# EAGLE design eCog002_Proto_SMD (EAGLE 6.6.0)
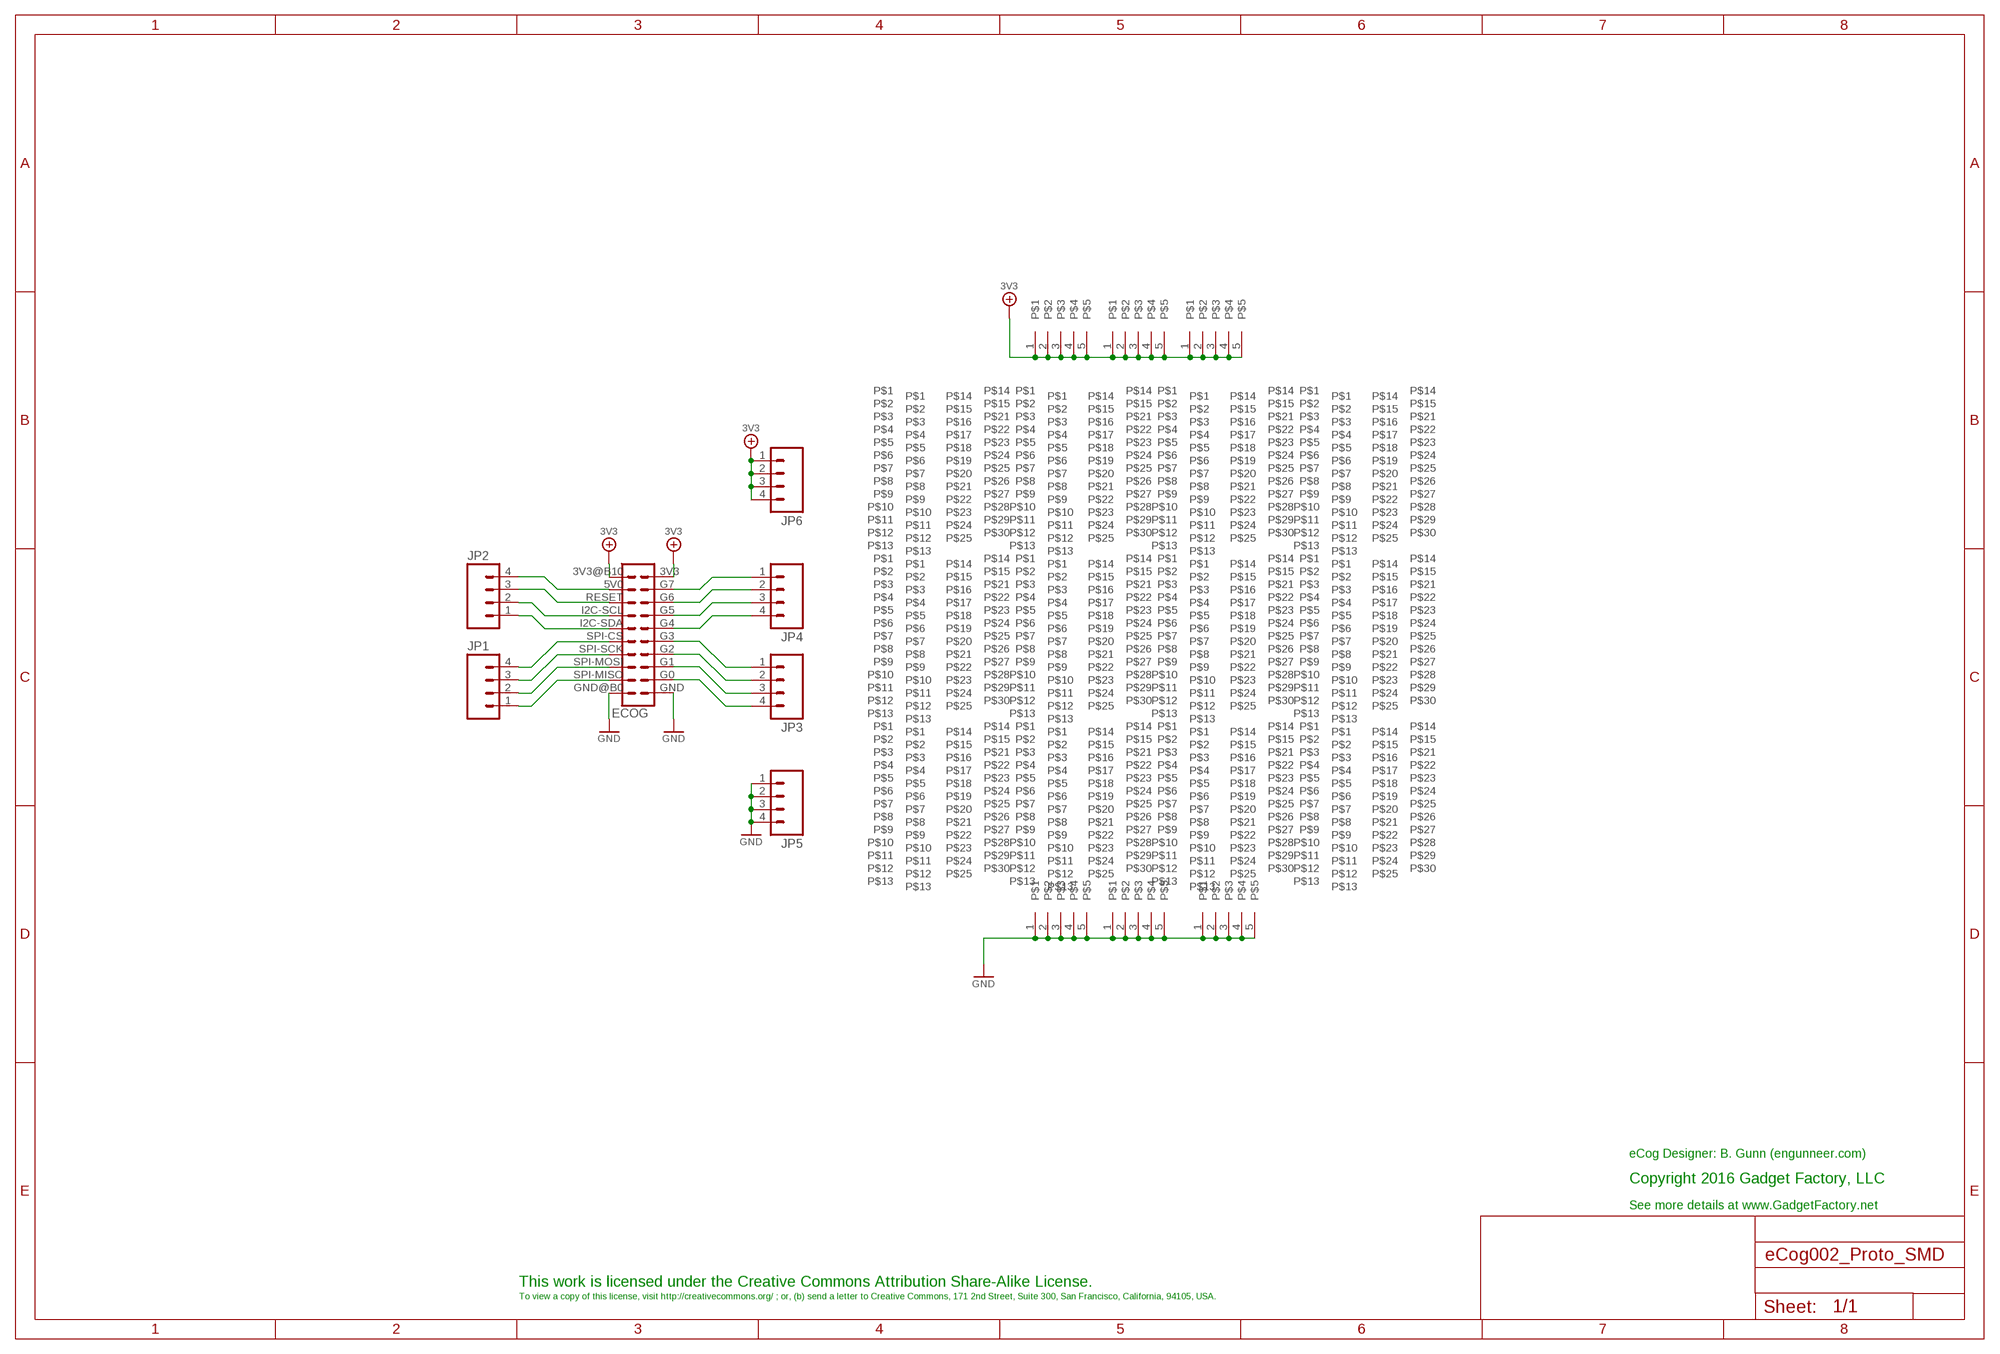
[diagram p0: schematic, sheet 1]

## Parts
ECOG  ECOG_DUALTHROUGHHOLE  [ECOG_DUAL_TH]
JP1  M041.27MM  [1X04-1.27MM]
JP2  M041.27MM  [1X04-1.27MM]
JP3  M041.27MM  [1X04-1.27MM]
JP4  M041.27MM  [1X04-1.27MM]
JP5  M041.27MM  [1X04-1.27MM]
JP6  M041.27MM  [1X04-1.27MM]
U$2  SMD_PROTO_2550X65  [SMD-5065]
U$3  SMD_PROTO_2550X65  [SMD-5065]
U$4  SMD_PROTO_2550X65  [SMD-5065]
U$5  SMD_PROTO_2550X65  [SMD-5065]
U$6  SMD_PROTO_2550X65  [SMD-5065]
U$7  SMD_PROTO_2550X65  [SMD-5065]
U$8  SMD_PROTO_2550X65  [SMD-5065]
U$9  SMD_PROTO_2550X65  [SMD-5065]
U$11  SMD_PROTO_2550X65  [SMD-5065]
U$12  SMD_PROTO_2550X65  [SMD-5065]
U$13  SMD_PROTO_2550X65  [SMD-5065]
U$14  SMD_PROTO_2550X65  [SMD-5065]
U$15  SMD_PROTO_55  [SMD-5065-5]
U$16  SMD_PROTO_55  [SMD-5065-5]
U$17  SMD_PROTO_55  [SMD-5065-5]
U$18  SMD_PROTO_55  [SMD-5065-5]
U$19  SMD_PROTO_55  [SMD-5065-5]
U$20  SMD_PROTO_55  [SMD-5065-5]

## Nets
3V3: ECOG.3V3 ECOG.3V3@B10(3V3) JP6.1 JP6.2 JP6.3 JP6.4 U$15.1 U$15.2 U$15.3 U$15.4 U$15.5 U$16.1 U$16.2 U$16.3 U$16.4 U$16.5 U$17.1 U$17.2 U$17.3 U$17.4 U$17.5
GND: ECOG.GND ECOG.GND@B0(GND) JP5.1 JP5.2 JP5.3 JP5.4 U$18.1 U$18.2 U$18.3 U$18.4 U$18.5 U$19.1 U$19.2 U$19.3 U$19.4 U$19.5 U$20.1 U$20.2 U$20.3 U$20.4 U$20.5
N$1: ECOG.G7 JP4.1
N$2: ECOG.G6 JP4.2
N$3: ECOG.G5 JP4.3
N$4: ECOG.G4 JP4.4
N$5: ECOG.G3 JP3.1
N$6: ECOG.G2 JP3.2
N$7: ECOG.G1 JP3.3
N$8: ECOG.G0 JP3.4
N$9: ECOG.SPI-MISO JP1.1
N$10: ECOG.SPI-MOSI JP1.2
N$11: ECOG.SPI-SCK JP1.3
N$12: ECOG.SPI-CS JP1.4
N$13: ECOG.I2C-SDA JP2.1
N$14: ECOG.I2C-SCL JP2.2
N$15: ECOG.RESET JP2.3
N$16: ECOG.5V0(5V) JP2.4
Unconnected: U$2.P$1 U$2.P$2 U$2.P$3 U$2.P$4 U$2.P$5 U$2.P$6 U$2.P$7 U$2.P$8 U$2.P$9 U$2.P$10 U$2.P$11 U$2.P$12 U$2.P$13 U$2.P$14 U$2.P$15 U$2.P$21 U$2.P$22 U$2.P$23 U$2.P$24 U$2.P$25 U$2.P$26 U$2.P$27 U$2.P$28 U$2.P$29 U$2.P$30 U$3.P$1 U$3.P$2 U$3.P$3 U$3.P$4 U$3.P$5 U$3.P$6 U$3.P$7 U$3.P$8 U$3.P$9 U$3.P$10 U$3.P$11 U$3.P$12 U$3.P$13 U$3.P$14 U$3.P$15 U$3.P$21 U$3.P$22 U$3.P$23 U$3.P$24 U$3.P$25 U$3.P$26 U$3.P$27 U$3.P$28 U$3.P$29 U$3.P$30 U$4.P$1 U$4.P$2 U$4.P$3 U$4.P$4 U$4.P$5 U$4.P$6 U$4.P$7 U$4.P$8 U$4.P$9 U$4.P$10 U$4.P$11 U$4.P$12 U$4.P$13 U$4.P$14 U$4.P$15 U$4.P$21 U$4.P$22 U$4.P$23 U$4.P$24 U$4.P$25 U$4.P$26 U$4.P$27 U$4.P$28 U$4.P$29 U$4.P$30 U$5.P$1 U$5.P$2 U$5.P$3 U$5.P$4 U$5.P$5 U$5.P$6 U$5.P$7 U$5.P$8 U$5.P$9 U$5.P$10 U$5.P$11 U$5.P$12 U$5.P$13 U$5.P$14 U$5.P$15 U$5.P$21 U$5.P$22 U$5.P$23 U$5.P$24 U$5.P$25 U$5.P$26 U$5.P$27 U$5.P$28 U$5.P$29 U$5.P$30 U$6.P$1 U$6.P$2 U$6.P$3 U$6.P$4 U$6.P$5 U$6.P$6 U$6.P$7 U$6.P$8 U$6.P$9 U$6.P$10 U$6.P$11 U$6.P$12 U$6.P$13 U$6.P$14 U$6.P$15 U$6.P$21 U$6.P$22 U$6.P$23 U$6.P$24 U$6.P$25 U$6.P$26 U$6.P$27 U$6.P$28 U$6.P$29 U$6.P$30 U$7.P$1 U$7.P$2 U$7.P$3 U$7.P$4 U$7.P$5 U$7.P$6 U$7.P$7 U$7.P$8 U$7.P$9 U$7.P$10 U$7.P$11 U$7.P$12 U$7.P$13 U$7.P$14 U$7.P$15 U$7.P$21 U$7.P$22 U$7.P$23 U$7.P$24 U$7.P$25 U$7.P$26 U$7.P$27 U$7.P$28 U$7.P$29 U$7.P$30 U$8.P$1 U$8.P$2 U$8.P$3 U$8.P$4 U$8.P$5 U$8.P$6 U$8.P$7 U$8.P$8 U$8.P$9 U$8.P$10 U$8.P$11 U$8.P$12 U$8.P$13 U$8.P$14 U$8.P$15 U$8.P$21 U$8.P$22 U$8.P$23 U$8.P$24 U$8.P$25 U$8.P$26 U$8.P$27 U$8.P$28 U$8.P$29 U$8.P$30 U$9.P$1 U$9.P$2 U$9.P$3 U$9.P$4 U$9.P$5 U$9.P$6 U$9.P$7 U$9.P$8 U$9.P$9 U$9.P$10 U$9.P$11 U$9.P$12 U$9.P$13 U$9.P$14 U$9.P$15 U$9.P$21 U$9.P$22 U$9.P$23 U$9.P$24 U$9.P$25 U$9.P$26 U$9.P$27 U$9.P$28 U$9.P$29 U$9.P$30 U$11.P$1 U$11.P$2 U$11.P$3 U$11.P$4 U$11.P$5 U$11.P$6 U$11.P$7 U$11.P$8 U$11.P$9 U$11.P$10 U$11.P$11 U$11.P$12 U$11.P$13 U$11.P$14 U$11.P$15 U$11.P$21 U$11.P$22 U$11.P$23 U$11.P$24 U$11.P$25 U$11.P$26 U$11.P$27 U$11.P$28 U$11.P$29 U$11.P$30 U$12.P$1 U$12.P$2 U$12.P$3 U$12.P$4 U$12.P$5 U$12.P$6 U$12.P$7 U$12.P$8 U$12.P$9 U$12.P$10 U$12.P$11 U$12.P$12 U$12.P$13 U$12.P$14 U$12.P$15 U$12.P$21 U$12.P$22 U$12.P$23 U$12.P$24 U$12.P$25 U$12.P$26 U$12.P$27 U$12.P$28 U$12.P$29 U$12.P$30 U$13.P$1 U$13.P$2 U$13.P$3 U$13.P$4 U$13.P$5 U$13.P$6 U$13.P$7 U$13.P$8 U$13.P$9 U$13.P$10 U$13.P$11 U$13.P$12 U$13.P$13 U$13.P$14 U$13.P$15 U$13.P$21 U$13.P$22 U$13.P$23 U$13.P$24 U$13.P$25 U$13.P$26 U$13.P$27 U$13.P$28 U$13.P$29 U$13.P$30 U$14.P$1 U$14.P$2 U$14.P$3 U$14.P$4 U$14.P$5 U$14.P$6 U$14.P$7 U$14.P$8 U$14.P$9 U$14.P$10 U$14.P$11 U$14.P$12 U$14.P$13 U$14.P$14 U$14.P$15 U$14.P$21 U$14.P$22 U$14.P$23 U$14.P$24 U$14.P$25 U$14.P$26 U$14.P$27 U$14.P$28 U$14.P$29 U$14.P$30

## Notes on the sheet
- eCog Designer: B. Gunn (engunneer.com)
- Copyright 2016 Gadget Factory, LLC
- See more details at www.GadgetFactory.net
- This work is licensed under the Creative Commons Attribution Share-Alike License.
- To view a copy of this license, visit http://creativecommons.org/ ; or, (b) send a letter to Creative Commons, 171 2nd Street, Suite 300, San Francisco, California, 94105, USA.

## Library data of the parts
ECOG = eCogs:ECOG_DUAL
JP1-JP6 = SparkFun-Connectors:M04: Header 4 Standard 4-pin 0.1" header. Use with straight break away headers (SKU : PRT-00116), right angle break away headers (PRT-00553), swiss pins (PRT-00743), machine pins (PRT-00117), and female headers (PRT-00115). Molex polarized connector foot print use with SKU : PRT-08231 with associated crimp pins and housings. 1MM SMD Version SKU: PRT-10208
U$2-U$9 U$11-U$14 = engunneer-proto:SMD_PROTO_25
U$15-U$20 = engunneer-proto:SMD_PROTO_5

## Board
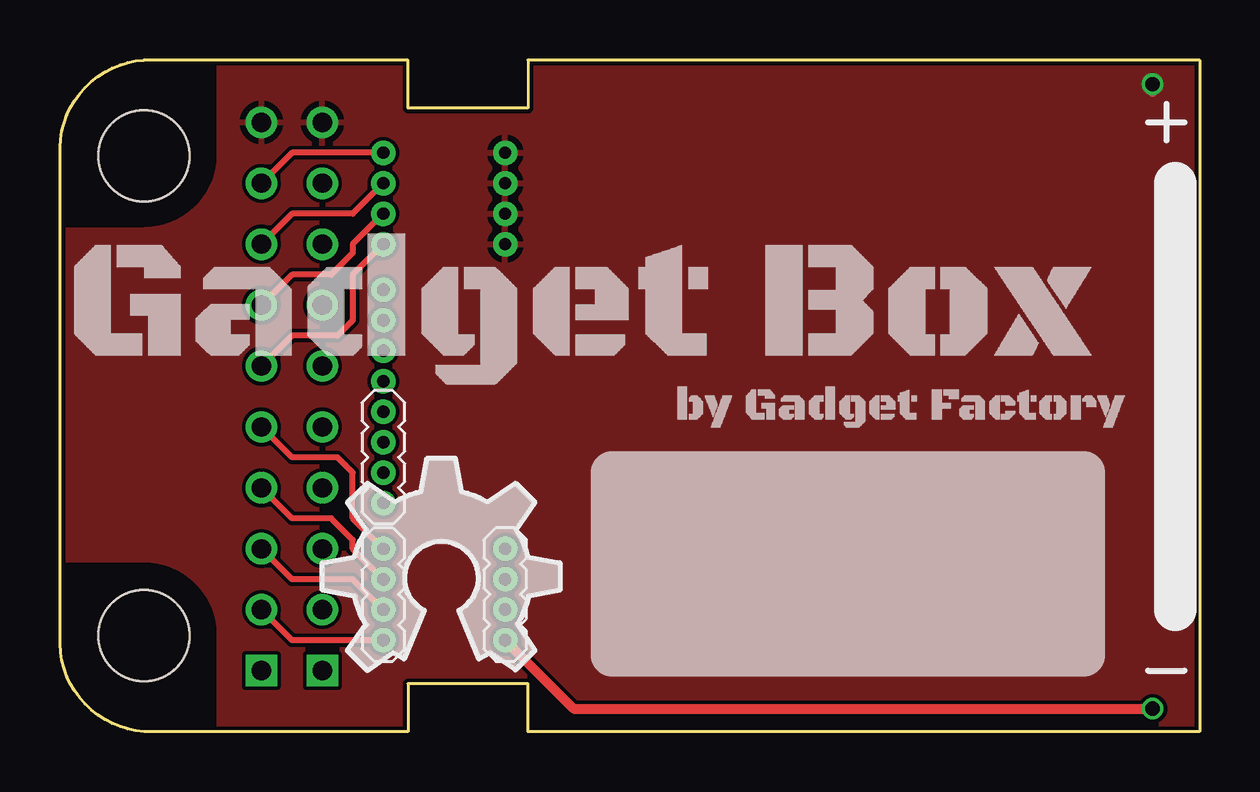
[diagram p1: board, top side]
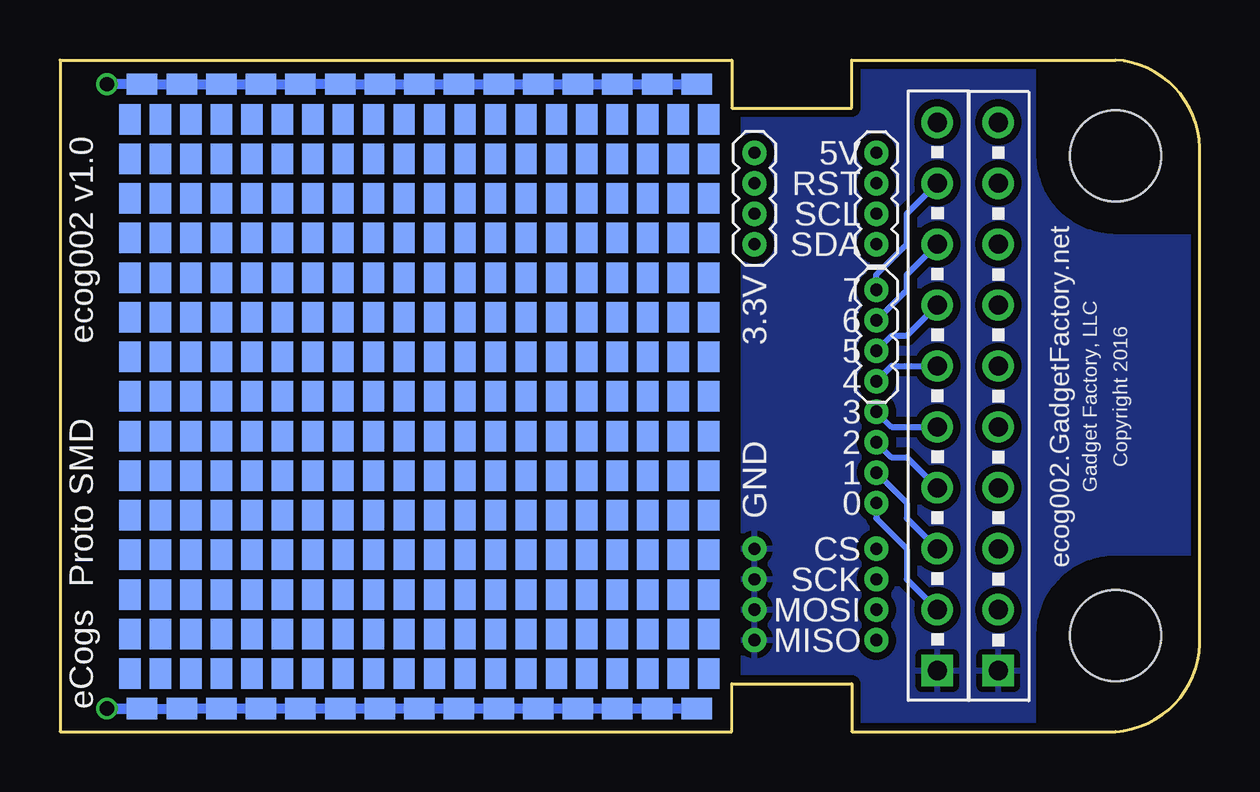
[diagram p2: board, bottom side, seen from below]

Size 47.51 x 28 mm. Coordinates in mm from the lower left corner, seen from the top.
Copper layers (1*16): Top 0.035mm / dielectric 1.5mm / Bottom 0.035mm
Design rules "hackvana *": minimum track width 6mil, minimum drill 0.3mm, track to track 6mil, track to pad 6mil, pad to pad 6mil, via to via 6mil, smd to smd 0mil, copper to edge 6mil, drill to drill 6mil, minimum pad ring 10mil, minimum via ring 6mil, stop-mask expansion 2mil, vias tented up to drill 100mil, thermal gap 10mil

### Footprints (pad centres in the part's own frame; a part is rotated, then mirrored left to right if it is on the bottom)
ECOG_DUAL_TH = drill 0.8: 3V3 11.43,25.4; 3V3@B10 8.89,25.4; 5V0 8.89,22.86; G0 11.43,5.08; G1 11.43,7.62; G2 11.43,10.16; G3 11.43,12.7; G4 11.43,15.24; G5 11.43,17.78; G6 11.43,20.32; G7 11.43,22.86; I2C-SCL 8.89,17.78; I2C-SDA 8.89,15.24; RESET 8.89,20.32; SPI-CS 8.89,12.7; SPI-MISO 8.89,5.08; SPI-MOSI 8.89,7.62; SPI-SCK 8.89,10.16 | drill 0.8 square: GND 11.43,2.54; GND@B0 8.89,2.54 | hole 3.8: 4,24; 4,4
1X04-1.27MM = drill 0.508 pad 1: 1 0,0; 2 1.27,0; 3 2.54,0; 4 3.81,0
SMD-5065 = smd 1.27 x 0.889: P$1 0,0; P$2 0,-1.27; P$3 0,-2.54; P$4 0,1.27; P$5 0,2.54; P$6 1.651,0; P$7 1.651,-1.27; P$8 1.651,-2.54; P$9 1.651,1.27; P$10 1.651,2.54; P$11 -1.651,0; P$12 -1.651,-1.27; P$13 -1.651,-2.54; P$14 -1.651,1.27; P$15 -1.651,2.54; P$21 -3.302,0; P$22 -3.302,-1.27; P$23 -3.302,-2.54; P$24 -3.302,1.27; P$25 -3.302,2.54; P$26 3.302,0; P$27 3.302,-1.27; P$28 3.302,-2.54; P$29 3.302,1.27; P$30 3.302,2.54
SMD-5065-5 = smd 1.27 x 0.889: 1 -3.302,0; 2 -1.651,0; 3 0,0; 4 1.651,0; 5 3.302,0

### Placement (x,y rotation side)
ECOG  -0.49,0 0 top
JP1  13.48,3.81 90 top
JP2  13.48,20.32 90 bottom
JP3  13.48,13.34 270 top
JP4  13.48,18.41 270 bottom
JP5  18.56,3.81 90 top
JP6  18.56,24.13 270 bottom
U$1  [GADGETBOX_TEXT]  21.86,17.4 0 top
U$2  42.05,5.71 270 bottom
U$3  23,5.71 90 bottom
U$4  23,13.97 90 bottom
U$5  29.35,5.71 90 bottom
U$6  35.7,5.71 90 bottom
U$7  23,22.23 90 bottom
U$8  29.35,22.23 90 bottom
U$9  35.7,22.23 90 bottom
U$10  [OSHW_FILLX350_NOTEXT]  10.94,2.54 0 top
U$11  42.05,22.23 90 bottom
U$12  29.35,13.97 90 bottom
U$13  35.7,13.97 90 bottom
U$14  42.05,13.97 270 bottom
U$15  24.27,26.99 0 bottom
U$16  32.53,26.99 0 bottom
U$17  40.78,26.99 0 bottom
U$18  24.27,0.95 0 bottom
U$19  32.53,0.95 0 bottom
U$20  40.78,0.95 0 bottom

### Tracks (layer width: path | path; a pad name or v marks a point on that pad's centre or on a via)
3V3  (via drill 0.6)
  Top 0.406: v45.55,26.99 45.55,26.67
  Bottom 0.406: v45.55,26.99 U$17.1 U$17.2 U$17.3 U$17.4 U$17.5 U$16.1 | U$16.1 35.7,26.99 | U$16.1 U$16.2 U$16.3 U$16.4 U$16.5 U$15.1 U$15.2 U$15.3 U$15.4 U$15.5 20.78,26.99
  pour Top: -1.49,29 47.87,29 47.87,-1 -1.49,-1
GND  (via drill 0.6)
  Top 0.406: JP5.1 21.41,0.95 v45.55,0.95
  Bottom 0.406: U$20.1 v45.55,0.95 U$20.2 U$20.3 U$20.4 U$20.5 U$19.1 U$19.2 U$19.3 U$19.4 U$19.5 U$18.1 U$18.2 U$18.3 U$18.4 U$18.5
  pour Bottom (isolate 0.305): -2.49,30 19.03,30 19.03,-2 -2.49,-2
N$1
  Bottom 0.254: ECOG.G7 12.21,21.59 12.21,20.32 13.48,19.05 JP4.1
N$2
  Bottom 0.254: JP4.2 12.21,18.41 12.21,19.05 ECOG.G6
N$3
  Bottom 0.254: JP4.3 12.84,16.51 12.21,16.51 ECOG.G5
N$4
  Bottom 0.254: JP4.4 12.84,15.24 ECOG.G4
N$5
  Bottom 0.254: JP3.1 12.84,12.7 ECOG.G3
N$6
  Bottom 0.254: JP3.2 12.84,11.43 12.21,11.43 ECOG.G2
N$7
  Bottom 0.254: JP3.3 12.21,9.53 12.21,8.89 ECOG.G1
N$8
  Bottom 0.254: JP3.4 13.48,8.89 12.21,7.62 12.21,6.35 ECOG.G0
N$9
  Top 0.254: JP1.1 9.67,3.81 ECOG.SPI-MISO
N$10
  Top 0.254: JP1.2 12.21,6.35 9.67,6.35 ECOG.SPI-MOSI
N$11
  Top 0.254: JP1.3 12.21,7.62 12.21,7.99 11.31,8.89 9.67,8.89 ECOG.SPI-SCK
N$12
  Top 0.254: JP1.4 12.21,8.89 12.21,10.79 11.57,11.43 9.67,11.43 ECOG.SPI-CS
N$13
  Top 0.254: JP2.1 12.21,19.05 12.21,17.14 11.57,16.51 9.67,16.51 ECOG.I2C-SDA
N$14
  Top 0.254: JP2.2 12.21,20.32 12.21,19.95 11.31,19.05 9.67,19.05 ECOG.I2C-SCL
N$15
  Top 0.254: JP2.3 12.21,21.59 9.67,21.59 ECOG.RESET
N$16
  Top 0.254: JP2.4 9.67,24.13 ECOG.5V0

### Text on the board
bPlace: 5V | RST | SCL | SDA | 3.3V | 7 | 6 | 5 | ecog002 v1.0 | 4 | Copyright 2016 | Gadget Factory, LLC | ecog002.GadgetFactory.net | 3 | 2 | 1 | 0 | GND | CS | SCK | Proto SMD | MOSI | MISO | eCogs